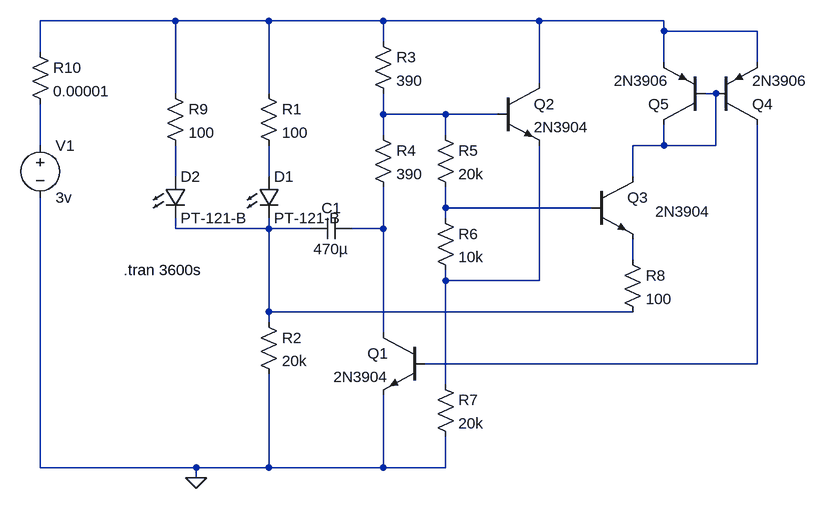
[diagram p0: schematic lm3909_discreet.asc]
lm3909_discreet.asc, the LTspice schematic file:
Version 4
SHEET 1 1092 680
WIRE 80 -64 -128 -64
WIRE 224 -64 80 -64
WIRE 400 -64 224 -64
WIRE 640 -64 400 -64
WIRE 832 -64 640 -64
WIRE 832 -48 832 -64
WIRE 976 -48 832 -48
WIRE 400 -32 400 -64
WIRE -128 -16 -128 -64
WIRE 832 0 832 -48
WIRE 976 0 976 -48
WIRE 640 32 640 -64
WIRE 80 48 80 -64
WIRE 224 48 224 -64
WIRE 912 48 896 48
WIRE 400 80 400 48
WIRE 496 80 400 80
WIRE 576 80 496 80
WIRE 400 112 400 80
WIRE 496 112 496 80
WIRE -128 128 -128 64
WIRE 832 128 832 96
WIRE 832 128 784 128
WIRE 912 128 912 48
WIRE 912 128 832 128
WIRE 80 176 80 128
WIRE 224 176 224 128
WIRE 784 176 784 128
WIRE 496 224 496 192
WIRE 720 224 496 224
WIRE 496 240 496 224
WIRE 80 256 80 240
WIRE 224 256 224 240
WIRE 224 256 80 256
WIRE 288 256 224 256
WIRE 400 256 400 192
WIRE 400 256 352 256
WIRE 784 304 784 272
WIRE 496 336 496 320
WIRE 640 336 640 128
WIRE 640 336 496 336
WIRE 224 384 224 256
WIRE 784 384 224 384
WIRE 224 400 224 384
WIRE 400 416 400 256
WIRE 976 464 976 96
WIRE 976 464 464 464
WIRE 496 496 496 336
WIRE -128 624 -128 208
WIRE 112 624 -128 624
WIRE 224 624 224 480
WIRE 224 624 112 624
WIRE 400 624 400 512
WIRE 400 624 224 624
WIRE 496 624 496 576
WIRE 496 624 400 624
WIRE 112 640 112 624
FLAG 112 640 0
SYMBOL res 208 32 R0
SYMATTR InstName R1
SYMATTR Value 100
SYMBOL res 208 384 R0
SYMATTR InstName R2
SYMATTR Value 20k
SYMBOL res 384 -48 R0
SYMATTR InstName R3
SYMATTR Value 390
SYMBOL res 384 96 R0
SYMATTR InstName R4
SYMATTR Value 390
SYMBOL res 480 96 R0
SYMATTR InstName R5
SYMATTR Value 20k
SYMBOL res 480 224 R0
SYMATTR InstName R6
SYMATTR Value 10k
SYMBOL res 480 480 R0
SYMATTR InstName R7
SYMATTR Value 20k
SYMBOL res 768 288 R0
SYMATTR InstName R8
SYMATTR Value 100
SYMBOL npn 464 416 M0
SYMATTR InstName Q1
SYMATTR Value 2N3904
SYMBOL npn 576 32 R0
SYMATTR InstName Q2
SYMATTR Value 2N3904
SYMBOL npn 720 176 R0
WINDOW 3 99 54 Left 2
SYMATTR Value 2N3904
SYMATTR InstName Q3
SYMBOL pnp 912 96 M180
SYMATTR InstName Q4
SYMATTR Value 2N3906
SYMBOL pnp 896 96 R180
SYMATTR InstName Q5
SYMATTR Value 2N3906
SYMBOL voltage -128 112 R0
WINDOW 123 0 0 Left 0
WINDOW 39 0 0 Left 0
SYMATTR InstName V1
SYMATTR Value 3v
SYMBOL LED 208 176 R0
SYMATTR InstName D1
SYMATTR Value PT-121-B
SYMATTR Description Diode
SYMATTR Type diode
SYMBOL cap 352 240 R90
WINDOW 0 0 32 VBottom 2
WINDOW 3 32 32 VTop 2
SYMATTR InstName C1
SYMATTR Value 470µ
SYMBOL res 64 32 R0
SYMATTR InstName R9
SYMATTR Value 100
SYMBOL LED 64 176 R0
SYMATTR InstName D2
SYMATTR Value PT-121-B
SYMATTR Description Diode
SYMATTR Type diode
SYMBOL res -144 -32 R0
SYMATTR InstName R10
SYMATTR Value 0.00001
TEXT 0 320 Left 2 !.tran 3600s

The netlist it stands for:
* lm3909_discreet.asc
R1 N001 N006 100
R2 N008 0 20k
R3 N001 N003 390
R4 N003 N009 390
R5 N003 N007 20k
R6 N007 N011 10k
R7 N011 0 20k
R8 N010 N008 100
Q1 N009 N012 0 0 2N3904
Q2 N001 N003 N011 0 2N3904
Q3 N002 N007 N010 0 2N3904
Q4 N012 N002 N001 0 2N3906
Q5 N002 N002 N001 0 2N3906
V1 N004 0 3v
D1 N006 N008 PT-121-B
C1 N009 N008 470µ
R9 N001 N005 100
D2 N005 N008 PT-121-B
R10 N001 N004 0.00001
.model D D
.lib standard.dio
.model NPN NPN
.model PNP PNP
.lib standard.bjt
.tran 3600s
.backanno
.end